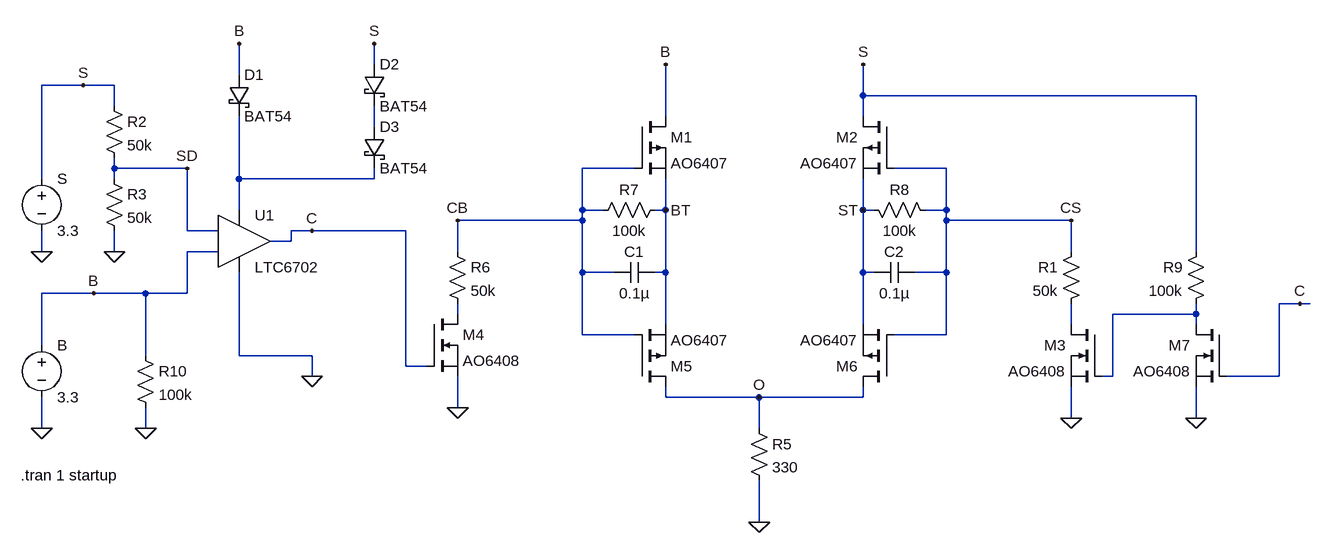
[diagram p0: schematic PMUX_Final_Design.asc]
PMUX_Final_Design.asc, the LTspice schematic file:
Version 4.1
SHEET 1 1352 680
WIRE -96 -480 -96 -512
WIRE -304 -464 -304 -512
WIRE -544 -448 -608 -448
WIRE -496 -448 -544 -448
WIRE 656 -432 656 -480
WIRE 1168 -432 656 -432
WIRE -496 -416 -496 -448
WIRE 352 -400 352 -480
WIRE 656 -400 656 -432
WIRE -96 -384 -96 -416
WIRE -496 -320 -496 -336
WIRE -384 -320 -496 -320
WIRE 304 -320 224 -320
WIRE 784 -320 704 -320
WIRE -608 -304 -608 -448
WIRE -496 -304 -496 -320
WIRE -304 -304 -304 -400
WIRE -96 -304 -96 -320
WIRE -96 -304 -304 -304
WIRE -304 -256 -304 -304
WIRE 224 -256 224 -320
WIRE 256 -256 224 -256
WIRE 352 -256 352 -304
WIRE 352 -256 336 -256
WIRE 656 -256 656 -304
WIRE 672 -256 656 -256
WIRE 784 -256 784 -320
WIRE 784 -256 752 -256
WIRE 224 -240 224 -256
WIRE 224 -240 32 -240
WIRE 784 -240 784 -256
WIRE 976 -240 784 -240
WIRE -384 -224 -384 -320
WIRE -336 -224 -384 -224
WIRE -192 -224 -224 -224
WIRE -48 -224 -192 -224
WIRE -224 -208 -224 -224
WIRE -224 -208 -256 -208
WIRE -608 -192 -608 -224
WIRE -496 -192 -496 -224
WIRE -336 -192 -384 -192
WIRE 32 -192 32 -240
WIRE 976 -192 976 -240
WIRE 1168 -192 1168 -432
WIRE 224 -160 224 -240
WIRE 272 -160 224 -160
WIRE 352 -160 352 -256
WIRE 352 -160 336 -160
WIRE 656 -160 656 -256
WIRE 672 -160 656 -160
WIRE 784 -160 784 -240
WIRE 784 -160 736 -160
WIRE -528 -128 -608 -128
WIRE -448 -128 -528 -128
WIRE -384 -128 -384 -192
WIRE -384 -128 -448 -128
WIRE 1328 -112 1296 -112
WIRE 1344 -112 1328 -112
WIRE 32 -96 32 -112
WIRE 1168 -96 1168 -112
WIRE 1168 -96 1040 -96
WIRE 352 -80 352 -160
WIRE 656 -80 656 -160
WIRE 976 -80 976 -112
WIRE 1168 -80 1168 -96
WIRE 224 -64 224 -160
WIRE 304 -64 224 -64
WIRE 784 -64 784 -160
WIRE 784 -64 704 -64
WIRE -608 -48 -608 -128
WIRE -448 -32 -448 -128
WIRE -304 -32 -304 -160
WIRE -192 -32 -304 -32
WIRE -48 -16 -48 -224
WIRE -16 -16 -48 -16
WIRE -192 0 -192 -32
WIRE 1040 0 1040 -96
WIRE 1040 0 1024 0
WIRE 1296 0 1296 -112
WIRE 1296 0 1216 0
WIRE 352 32 352 16
WIRE 496 32 352 32
WIRE 656 32 656 16
WIRE 656 32 496 32
WIRE 32 48 32 0
WIRE 976 64 976 16
WIRE 1168 64 1168 16
WIRE -608 80 -608 32
WIRE -448 80 -448 48
WIRE 496 80 496 32
WIRE 496 224 496 160
FLAG -608 -192 0
FLAG -608 80 0
FLAG -192 0 0
FLAG -192 -224 C
FLAG -544 -448 S
FLAG -528 -128 B
FLAG -304 -512 B
FLAG -96 -512 S
FLAG -496 -192 0
FLAG 496 224 0
FLAG 352 -480 B
FLAG 496 32 O
FLAG 32 48 0
FLAG 656 -480 S
FLAG 976 64 0
FLAG 1168 64 0
FLAG 1328 -112 C
FLAG -384 -320 SD
FLAG -448 80 0
FLAG 352 -256 BT
FLAG 656 -256 ST
FLAG 32 -240 CB
FLAG 976 -240 CS
SYMBOL voltage -608 -64 R0
WINDOW 123 0 0 Left 0
WINDOW 39 0 0 Left 0
SYMATTR InstName B
SYMATTR Value 3.3
SYMBOL voltage -608 -320 R0
WINDOW 123 0 0 Left 0
WINDOW 39 0 0 Left 0
SYMATTR InstName S
SYMATTR Value 3.3
SYMBOL schottky -320 -464 R0
SYMATTR InstName D1
SYMATTR Value BAT54
SYMATTR Description Diode
SYMATTR Type diode
SYMBOL res -512 -432 R0
SYMATTR InstName R2
SYMATTR Value 50k
SYMBOL res -512 -320 R0
SYMATTR InstName R3
SYMATTR Value 50k
SYMBOL schottky -112 -480 R0
SYMATTR InstName D2
SYMATTR Value BAT54
SYMATTR Description Diode
SYMATTR Type diode
SYMBOL schottky -112 -384 R0
SYMATTR InstName D3
SYMATTR Value BAT54
SYMATTR Description Diode
SYMATTR Type diode
SYMBOL pmos 304 -400 R0
SYMATTR InstName M1
SYMATTR Value AO6407
SYMBOL res 480 64 R0
SYMATTR InstName R5
SYMATTR Value 330
SYMBOL nmos -16 -96 R0
SYMATTR InstName M4
SYMATTR Value AO6408
SYMBOL res 16 -208 R0
SYMATTR InstName R6
SYMATTR Value 50k
SYMBOL pmos 304 16 M180
SYMATTR InstName M5
SYMATTR Value AO6407
SYMBOL res 352 -272 R90
WINDOW 0 0 56 VBottom 2
WINDOW 3 32 56 VTop 2
SYMATTR InstName R7
SYMATTR Value 100k
SYMBOL cap 336 -176 R90
WINDOW 0 0 32 VBottom 2
WINDOW 3 32 32 VTop 2
SYMATTR InstName C1
SYMATTR Value 0.1µ
SYMBOL pmos 704 -400 M0
SYMATTR InstName M2
SYMATTR Value AO6407
SYMBOL nmos 1024 -80 M0
SYMATTR InstName M3
SYMATTR Value AO6408
SYMBOL res 992 -208 M0
SYMATTR InstName R1
SYMATTR Value 50k
SYMBOL pmos 704 16 R180
SYMATTR InstName M6
SYMATTR Value AO6407
SYMBOL res 656 -272 M90
WINDOW 0 0 56 VBottom 2
WINDOW 3 32 56 VTop 2
SYMATTR InstName R8
SYMATTR Value 100k
SYMBOL cap 672 -176 M90
WINDOW 0 0 32 VBottom 2
WINDOW 3 32 32 VTop 2
SYMATTR InstName C2
SYMATTR Value 0.1µ
SYMBOL nmos 1216 -80 M0
SYMATTR InstName M7
SYMATTR Value AO6408
SYMBOL res 1184 -208 M0
SYMATTR InstName R9
SYMATTR Value 100k
SYMBOL Comparators\\LTC6702 -304 -208 R0
SYMATTR InstName U1
SYMBOL res -464 -48 R0
SYMATTR InstName R10
SYMATTR Value 100k
TEXT -640 152 Left 2 !.tran 1 startup

The netlist it stands for:
* PMUX_Final_Design.asc
V§B B 0 3.3
V§S S 0 3.3
D1 B N002 BAT54
R2 S SD 50k
R3 SD 0 50k
D2 S N001 BAT54
D3 N001 N002 BAT54
M1 B CB BT BT AO6407
R5 O 0 330
M4 N003 C 0 0 AO6408
R6 CB N003 50k
M5 O CB BT BT AO6407
R7 BT CB 100k
C1 BT CB 0.1µ
M2 S CS ST ST AO6407
M3 N005 N004 0 0 AO6408
R1 CS N005 50k
M6 O CS ST ST AO6407
R8 ST CS 100k
C2 ST CS 0.1µ
M7 N004 C 0 0 AO6408
R9 S N004 100k
X§U1 B SD N002 0 C LTC6702
R10 B 0 100k
.model D D
.lib standard.dio
.model NMOS NMOS
.model PMOS PMOS
.lib standard.mos
.tran 1 startup
.lib LTC3.lib
.backanno
.end

* Results of the author's LTspice run, read from the files saved beside the schematic
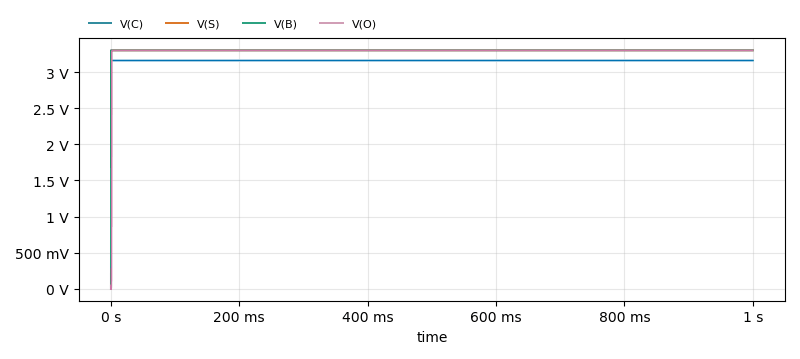
[diagram p1: Transient Analysis of PMUX_Final_Design.asc, plotted from the saved traces]
* Transient Analysis, 1 run:
*   V(C): min 0 V, max 3.16 V, average 3.16 V, rms 3.16 V, last 3.16 V
*   V(S): min 0 V, max 3.3 V, average 3.3 V, rms 3.3 V, last 3.3 V
*   V(B): min 0 V, max 3.3 V, average 3.3 V, rms 3.3 V, last 3.3 V
*   V(O): min 0 V, max 3.299 V, average 3.295 V, rms 3.297 V, last 3.299 V